# EAGLE schematic femtoBeacon_PRO_r3.0.1_single_sided (EAGLE 7.6.0)

## Sheet 1 of 2
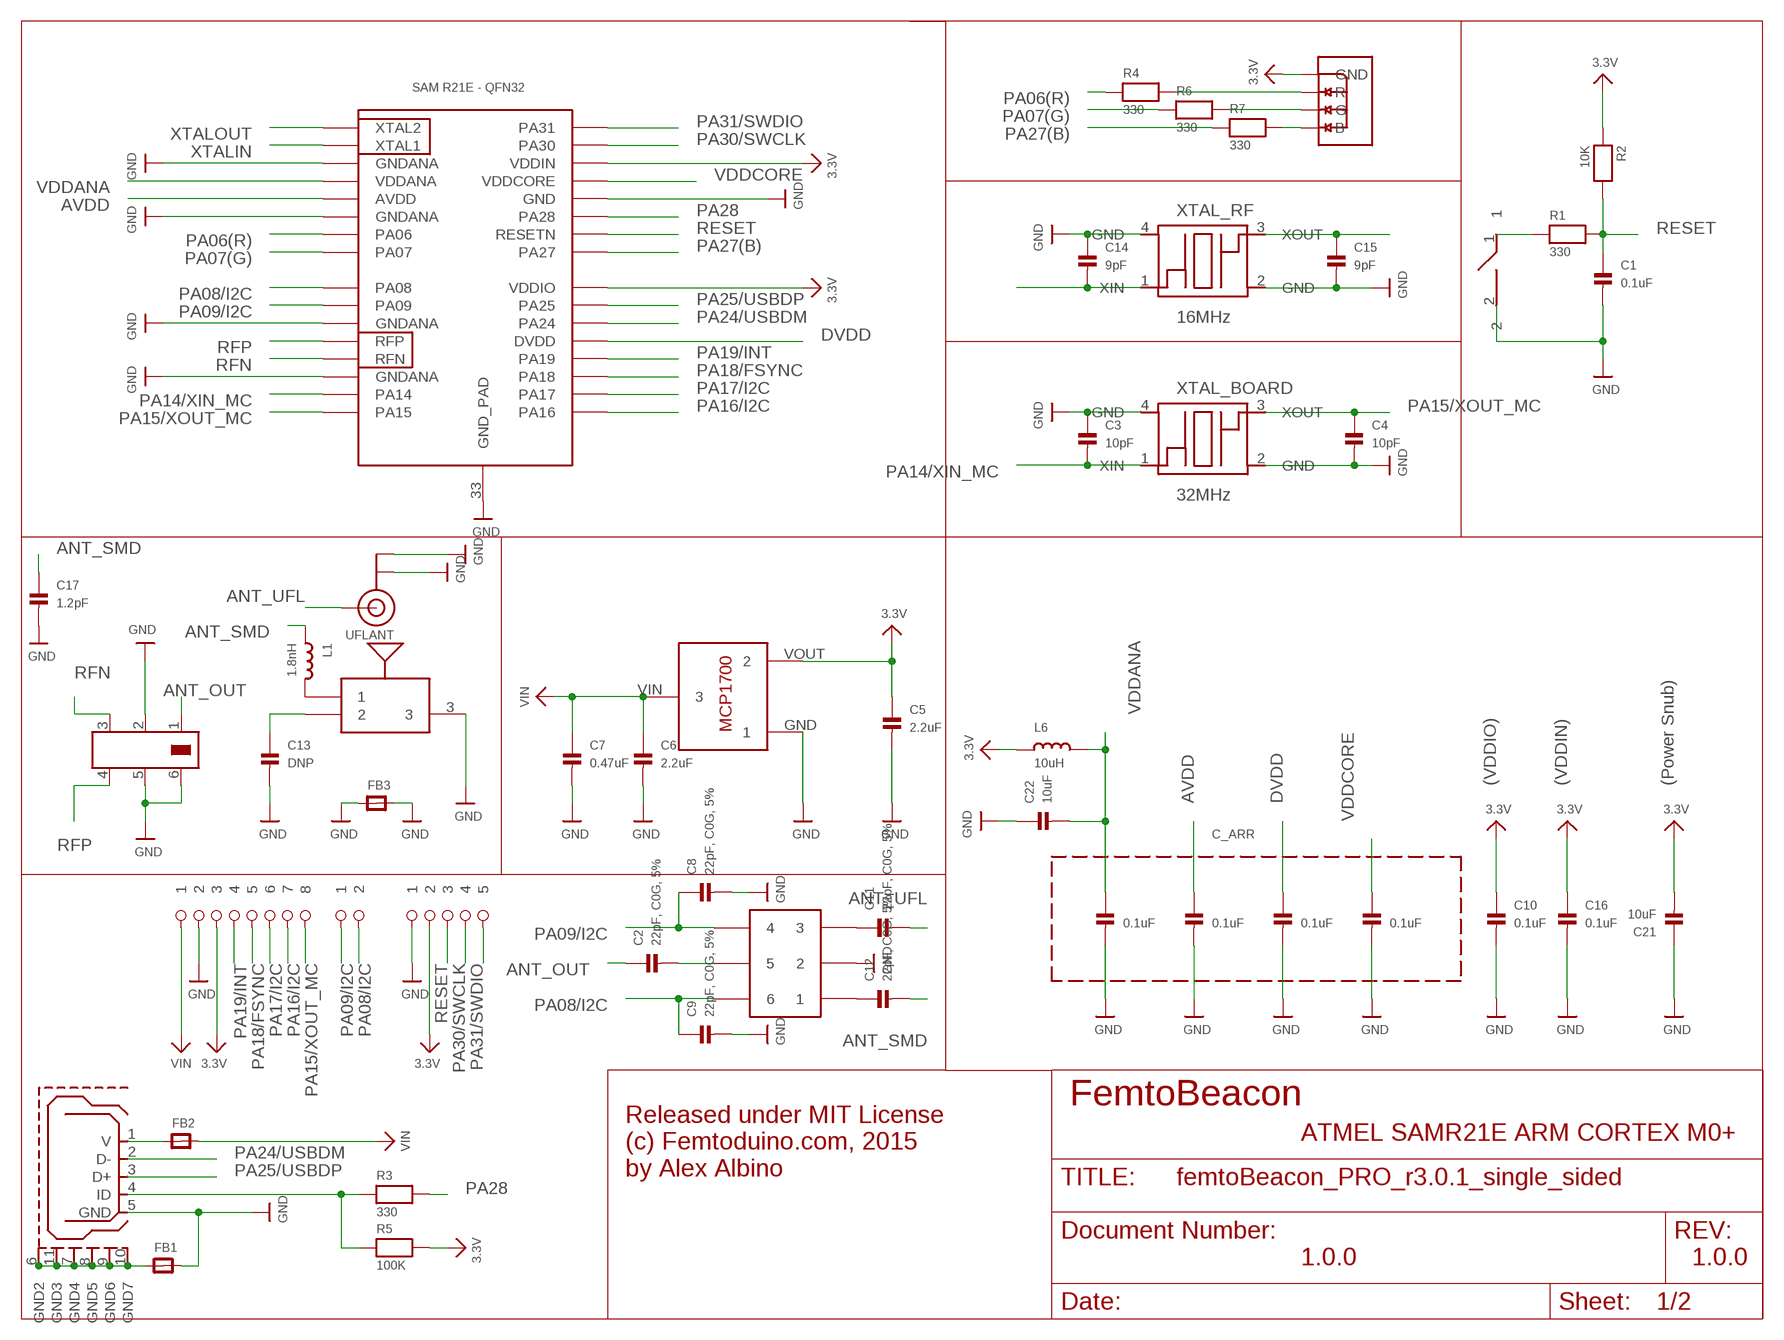
[diagram p0: schematic, sheet 1]

### Parts
ASWITCH  AS222-92LF  [AS222-92LF]
BALUN  JOHANSON_2450BM15A0015E  [0805_BALUN]
BTN_RESET  DNP  SPST_SMD  [SPST_SMD]
C1  0.1uF  CAP_CERAMIC_0402MP  [_0402MP]
C2  22pF, C0G, 5%  CAP_CERAMIC_0402MP  [_0402MP]
C3  10pF  CAP_CERAMIC_0402MP  [_0402MP]
C4  10pF  CAP_CERAMIC_0402MP  [_0402MP]
C5  2.2uF  CAP_CERAMIC_0402MP  [_0402MP]
C6  2.2uF  CAP_CERAMIC_0402MP  [_0402MP]
C7  0.47uF  CAP_CERAMIC_0402MP  [_0402MP]
C8  22pF, C0G, 5%  CAP_CERAMIC_0402MP  [_0402MP]
C9  22pF, C0G, 5%  CAP_CERAMIC_0402MP  [_0402MP]
C10  0.1uF  CAP_CERAMIC_0402MP  [_0402MP]
C11  22pF, C0G, 5%  CAP_CERAMIC_0402MP  [_0402MP]
C12  22pF, C0G, 5%  CAP_CERAMIC_0402MP  [_0402MP]
C13  DNP  CAP_CERAMIC_0402MP  [_0402MP]
C14  9pF  CAP_CERAMIC_0402MP  [_0402MP]
C15  9pF  CAP_CERAMIC_0402MP  [_0402MP]
C16  0.1uF  CAP_CERAMIC_0402MP  [_0402MP]
C17  1.2pF  CAP_CERAMIC_0402MP  [_0402MP]
C21  10uF  CAP_CERAMIC_0402MP  [_0402MP]
C22  10uF  CAP_CERAMIC_0402MP  [_0402MP]
C_ARR  0.1uF  KEMET_CERAMIC_CAPACITOR_ARRAY_1X4  [CAPACITOR_ARRAY_1206_MONO_1X4]
FB1  FERRITE_0603MP  [_0603MP]
FB2  FERRITE_0603MP  [_0603MP]
FB3  FERRITE_0603MP  [_0603MP]
IC  ATSAMR21E18A-MUT  [QFN32]
L1  1.8nH  INDUCTOR_0603MP  [_0603MP]
L6  10uH  INDUCTOR_0603MP  [_0603MP]
LDO_VREG  MCP1700T-3302E/TT  [MCP1700T-3302E/TT]
R1  330  RESISTOR_0402MP  [_0402MP]
R2  10K  RESISTOR_0402MP  [_0402MP]
R3  330  RESISTOR_0402MP  [_0402MP]
R4  330  RESISTOR_0402MP  [_0402MP]
R5  100K  RESISTOR_0402MP  [_0402MP]
R6  330  RESISTOR_0402MP  [_0402MP]
R7  330  RESISTOR_0402MP  [_0402MP]
RGBLED  LRTB_R48G  [LRTB_R48G]
SMDANT  PULSE_ANT_2.4GHZ  [ANT_BAR]
U$5  1X8_ROUND  [1X8_ROUND]
U$9  1X2_ROUND  [1X2_ROUND]
U$10  1X5_ROUND  [1X5_ROUND]
UFLANT  ANTENNA_U.FL  [U.FL]
USB  USB_MICROB  [USB_MICROB_PACKAGE]
XTAL_BOARD  32MHz  FA-128  [FA-128]
XTAL_RF  16MHz  TSX-3225  [TSX-3225]

### Nets
3.3V: C5.1 C10.1 C16.1 C21.2 IC.24(VDDIO) IC.30(VDDIN) L6.1 LDO_VREG.VOUT R2.1 R5.2 RGBLED.1(GND) U$5.P$3 U$10.P$2 ; also sheet 2
ANT_OUT: BALUN.1 C2.1
ANT_SMD: C12.2 C17.1 L1.1
ANT_UFL: C11.2 UFLANT.3(SIGNAL)
AVDD: C_ARR.3 IC.5(AVDD)
DVDD: C_ARR.5 IC.21(DVDD)
GND: ASWITCH.PIN2 BALUN.2 BALUN.5 BALUN.6 BTN_RESET.2 C1.2 C3.1 C4.2 C5.2 C6.2 C7.2 C8.2 C9.2 C10.2 C13.2 C14.1 C15.2 C16.2 C17.2 C21.1 C22.1 C_ARR.2 C_ARR.4 C_ARR.6 C_ARR.8 FB1.2 FB3.1 FB3.2 IC.3(GNDANA) IC.6(GNDANA) IC.11(GNDANA) IC.14(GNDANA) IC.28(GND) IC.33(GND_PAD) LDO_VREG.GND SMDANT.3 U$5.P$2 U$10.P$1 UFLANT.1(GND) UFLANT.2(GND) USB.5(GND) XTAL_BOARD.2(GND) XTAL_BOARD.4(GND) XTAL_RF.2(GND) XTAL_RF.4(GND) ; also sheet 2
N$1: L1.2 SMDANT.1
N$2: C13.1 SMDANT.2
N$3: ASWITCH.PIN5 C2.2
N$5: FB1.1 USB.6(GND2) USB.7(GND4) USB.8(GND5) USB.9(GND6) USB.10(GND7) USB.11(GND3)
N$6: R3.1 R5.1 USB.4(ID)
N$7: FB2.1 USB.1(V)
N$8: R6.2 RGBLED.3(G)
N$9: R7.2 RGBLED.4(B)
N$10: ASWITCH.PIN3 C11.1
N$11: ASWITCH.PIN1 C12.1
N$13: R4.2 RGBLED.2(R)
N$26: BTN_RESET.1 R1.1
PA06(R): IC.7(PA06) R4.1
PA07(G): IC.8(PA07) R6.1
PA08/I2C: ASWITCH.PIN6 C9.1 IC.9(PA08) U$9.P$2
PA09/I2C: ASWITCH.PIN4 C8.1 IC.10(PA09) U$9.P$1
PA14/XIN_MC: C3.2 IC.15(PA14) XTAL_BOARD.1(XIN)
PA15/XOUT_MC: C4.1 IC.16(PA15) U$5.P$8 XTAL_BOARD.3(XOUT)
PA16/I2C: IC.17(PA16) U$5.P$7 ; also sheet 2
PA17/I2C: IC.18(PA17) U$5.P$6 ; also sheet 2
PA18/FSYNC: IC.19(PA18) U$5.P$5 ; also sheet 2
PA19/INT: IC.20(PA19) U$5.P$4 ; also sheet 2
PA24/USBDM: IC.22(PA24) USB.2(D-)
PA25/USBDP: IC.23(PA25) USB.3(D+)
PA27(B): IC.25(PA27) R7.1
PA28: IC.27(PA28) R3.2
PA30/SWCLK: IC.31(PA30) U$10.P$4
PA31/SWDIO: IC.32(PA31) U$10.P$5
RESET: C1.1 IC.26(RESETN) R1.2 R2.2 U$10.P$3
RFN: BALUN.3 IC.13(RFN)
RFP: BALUN.4 IC.12(RFP)
VDDANA: C22.2 C_ARR.1 IC.4(VDDANA) L6.2
VDDCORE: C_ARR.7 IC.29(VDDCORE)
VIN: C6.1 C7.1 FB2.2 LDO_VREG.VIN U$5.P$1
XTALIN: C14.2 IC.2(XTAL1) XTAL_RF.1(XIN)
XTALOUT: C15.1 IC.1(XTAL2) XTAL_RF.3(XOUT)

### Notes on the sheet
- (VDDIO) | (VDDIN) | (Power Snub)
- FemtoBeacon
- ATMEL SAMR21E ARM CORTEX M0+
- Released under MIT License
  (c) Femtoduino.com, 2015
  by Alex Albino
- 1.0.0 | 1.0.0

## Sheet 2 of 2
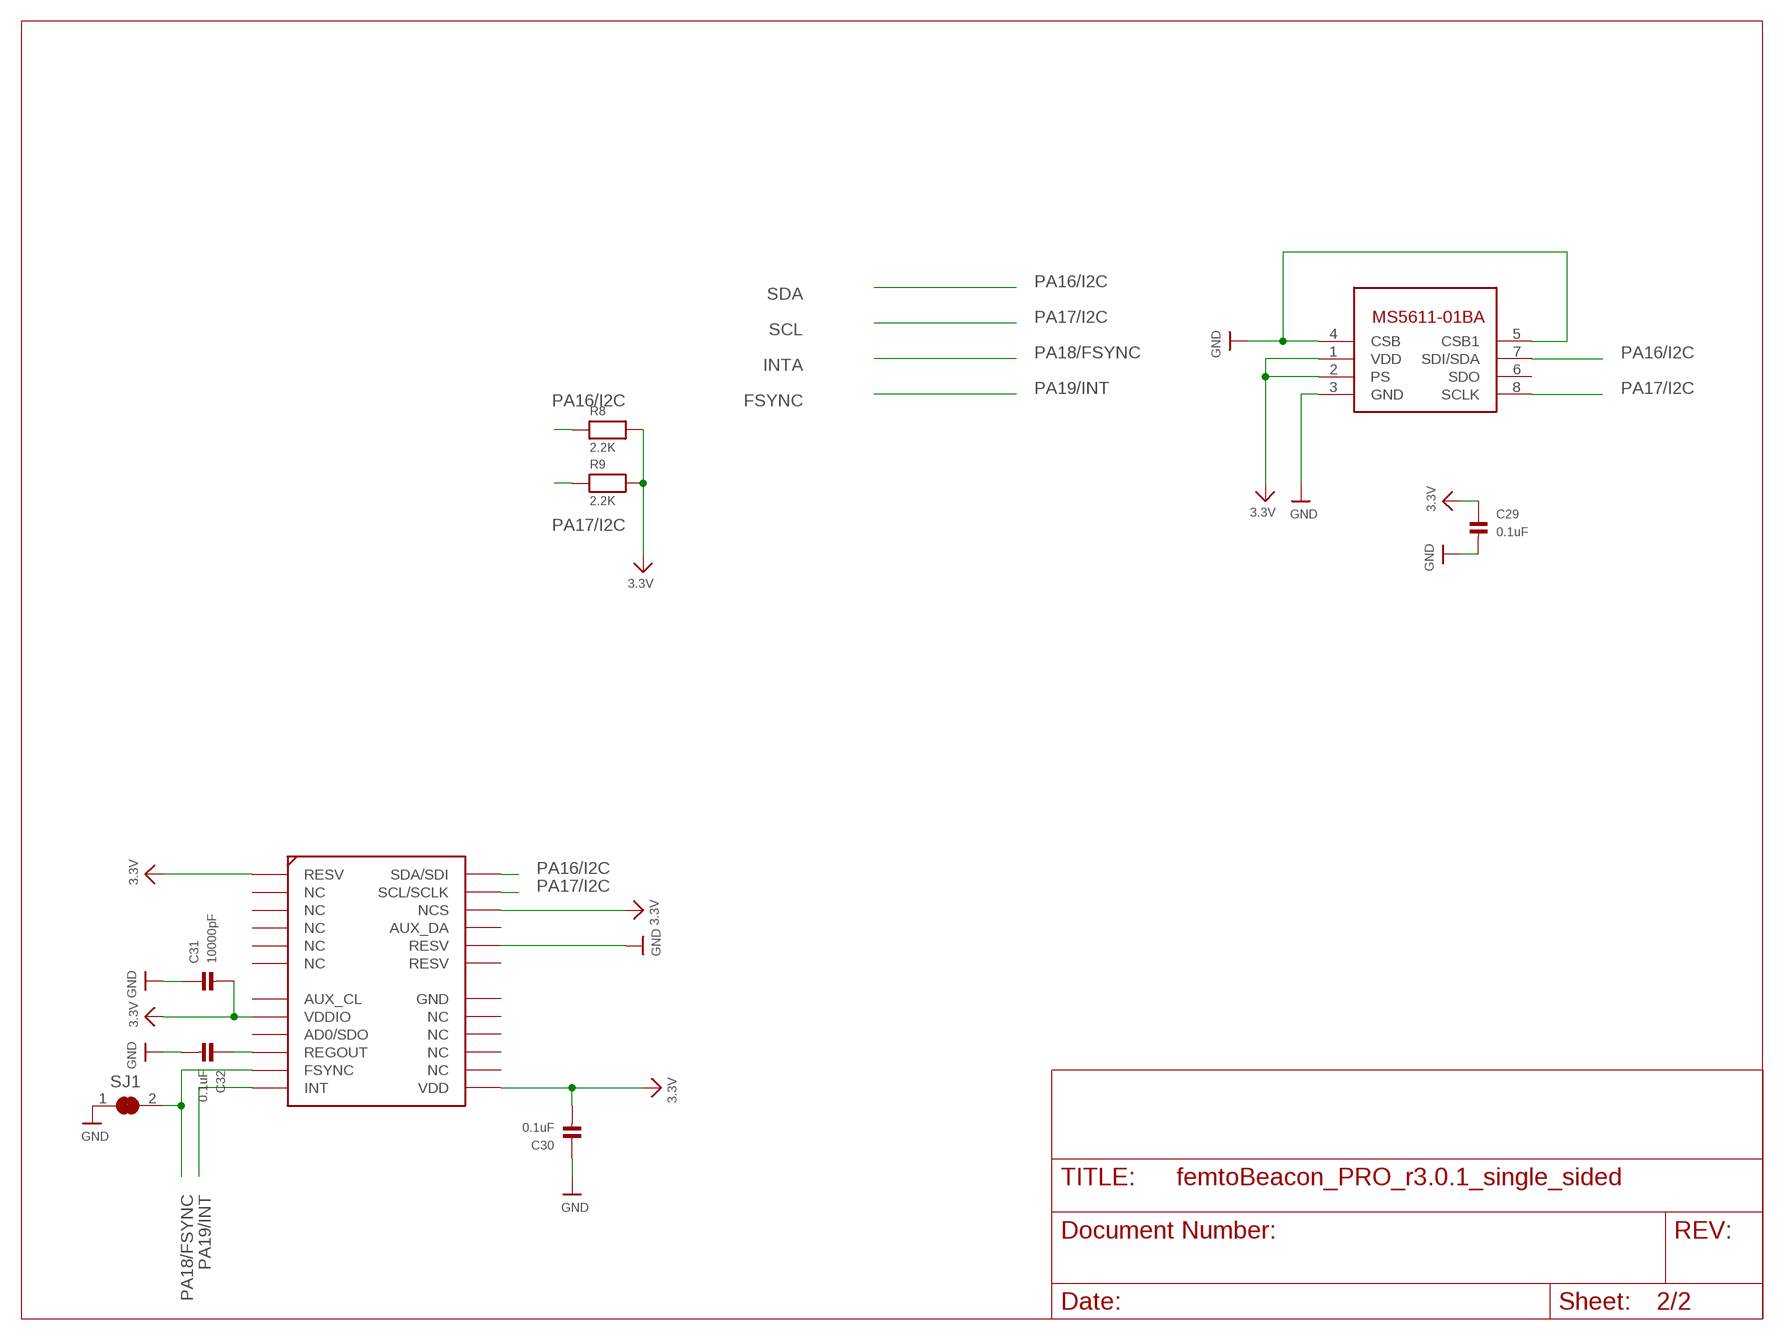
[diagram p1: schematic, sheet 2]

### Parts
BARO  MS5611-01BA03  [MS5611-01BA03]
C29  0.1uF  CAP_CERAMIC_0402MP  [_0402MP]
C30  0.1uF  CAP_CERAMIC_0402MP  [_0402MP]
C31  10000pF  CAP_CERAMIC_0402MP  [_0402MP]
C32  0.1uF  CAP_CERAMIC_0402MP  [_0402MP]
IMU  MPU-9250  [QFN_3X3MM]
R8  2.2K  RESISTOR_0402MP  [_0402MP]
R9  2.2K  RESISTOR_0402MP  [_0402MP]
SJ1  SOLDERJUMPER_CLOSED  [SOLDERJUMPER_CLOSEDWIRE]

### Nets
3.3V: BARO.1(VDD) BARO.2(PS) C29.1 C30.2 C31.2 IMU.P$1(RESV) IMU.P$8(VDDIO) IMU.P$13(VDD) IMU.P$22(NCS) R8.2 R9.2 ; also sheet 1
GND: BARO.3(GND) BARO.4(CSB) BARO.5(CSB1) C29.2 C30.1 C31.1 C32.2 IMU.P$20(RESV) SJ1.1 ; also sheet 1
N$4: C32.1 IMU.P$10(REGOUT)
PA16/I2C: BARO.7(SDI/SDA) IMU.P$24(SDA/SDI) R8.1 ; also sheet 1
PA17/I2C: BARO.8(SCLK) IMU.P$23(SCL/SCLK) R9.1 ; also sheet 1
PA18/FSYNC: IMU.P$11(FSYNC) SJ1.2 ; also sheet 1
PA19/INT: IMU.P$12(INT) ; also sheet 1
Unconnected: BARO.6(SDO) IMU.P$2(NC) IMU.P$3(NC) IMU.P$4(NC) IMU.P$5(NC) IMU.P$6(NC) IMU.P$7(AUX_CL) IMU.P$9(AD0/SDO) IMU.P$14(NC) IMU.P$15(NC) IMU.P$16(NC) IMU.P$17(NC) IMU.P$18(GND) IMU.P$19(RESV) IMU.P$21(AUX_DA)

### Notes on the sheet
- SDA
- SCL
- INTA
- FSYNC

## Library data of the parts
ASWITCH = skyworks_solutions:AS222-92LF
BALUN = balun:JOHANSON_2450BM15A0015E
BARO = freeimu:MS5611-01BA03
BTN_RESET = femtoduino:SPST_SMD
C1-C4 C8-C16 C29-C32 = microbuilder:CAP_CERAMIC: Ceramic Capacitors 0402 - 0402 Surface Mount Capacitors 16pF 50V 5% [Digikey: 445-4899-2-ND] 18pF 50V 5% [Digikey: 490-1281-2-ND] 22pF 50V 5% [Digikey: 490-1283-2-ND] 68pF 50V 5% [Digikey: 490-1289-2-ND] 0.1uF 10V 10% [Digikey: 490-1318-2-ND] 1.0uF 6.3V 10% [Digikey: 490-1320-2-ND] 0603 - 0603 Surface Mount Capacitors 16 pF 50V 5% [Digikey: 445-5051-2-ND] 22 pF 50V [Digikey: PCC220ACVTR-ND] 33 pF 50V 5% [Digikey: 490-1415-1-ND] 56pF 50V 5% [Digikey: 490-1421-1-ND] 220pF 50V 5% [Digikey: 445-1285-1-ND] 680 pF 50V 2200 pF 50V 5% C0G [Digikey: 445-1297-1-ND] 5600 pF 100V 5% X7R [Digikey: 478-3711-1-ND] 0.1 µF 25V 10% [Digikey: PCC2277TR-ND] 0.22 µF 16V 10% X7R [Digikey: 445-1318-1-ND] 1.0 µF 25V 10% [Digikey: 445-5146-2-ND] 0603 - RF Specific 3pF 250V +/-0.1pF RF [Digikey: 712-1347-1-ND] 18 pF 250V 5% [Digikey: 478-3505-1-ND or 712-1322-1-ND] 56 pF 250V 5% C0G RF [Digikey: 490-4867-1-ND] 68 pF 250V RF [Digikey: 490-4868-1-ND] 0805 - 0805 Surface Mount Capacitors 220 pF 250V 2% RF Ceramic Capacitor [Digikey: 712-1398-1-ND] 1000 pF 50V 2% NP0 Ceramic Capacitor [Digikey: 478-3760-1-ND] 0.1 µF 25V 10% Ceramic Capacitor [Digikey: PCC1828TR-ND] 1.0 µF 16V 10% Ceramic Capacitor[Digikey: 490-1691-2-ND] 10.0 µF 10V 10% Ceramic Capacitor[Digikey: 709-1228-1-ND] 10.0 uF 16V 10% Ceramic Capacitor [Digikey: 478-5165-2-ND] 47 uF 6.3V 20% Ceramic Capacitor [Digikey: 587-1779-1-ND or 399-5506-1-ND] 1206 - 1206 Surface Mount Capacitors 47uF 10V 20% Ceramic Capacitor [Digikey: 490-5528-1-ND or 399-5508-1-ND or 445-6010-1-ND] 100uF 6.3V -20%, +80% Y5V Ceramic Capacitor (Digikey: 490-4512-1-ND, Mouser: 81-GRM31CF50J107ZE1L); DIGIKEY_PART: 490-3194-1-ND
C5-C7 C17 C21 C22 = microbuilder:CAP_CERAMIC: Ceramic Capacitors 0402 - 0402 Surface Mount Capacitors 16pF 50V 5% [Digikey: 445-4899-2-ND] 18pF 50V 5% [Digikey: 490-1281-2-ND] 22pF 50V 5% [Digikey: 490-1283-2-ND] 68pF 50V 5% [Digikey: 490-1289-2-ND] 0.1uF 10V 10% [Digikey: 490-1318-2-ND] 1.0uF 6.3V 10% [Digikey: 490-1320-2-ND] 0603 - 0603 Surface Mount Capacitors 16 pF 50V 5% [Digikey: 445-5051-2-ND] 22 pF 50V [Digikey: PCC220ACVTR-ND] 33 pF 50V 5% [Digikey: 490-1415-1-ND] 56pF 50V 5% [Digikey: 490-1421-1-ND] 220pF 50V 5% [Digikey: 445-1285-1-ND] 680 pF 50V 2200 pF 50V 5% C0G [Digikey: 445-1297-1-ND] 5600 pF 100V 5% X7R [Digikey: 478-3711-1-ND] 0.1 µF 25V 10% [Digikey: PCC2277TR-ND] 0.22 µF 16V 10% X7R [Digikey: 445-1318-1-ND] 1.0 µF 25V 10% [Digikey: 445-5146-2-ND] 0603 - RF Specific 3pF 250V +/-0.1pF RF [Digikey: 712-1347-1-ND] 18 pF 250V 5% [Digikey: 478-3505-1-ND or 712-1322-1-ND] 56 pF 250V 5% C0G RF [Digikey: 490-4867-1-ND] 68 pF 250V RF [Digikey: 490-4868-1-ND] 0805 - 0805 Surface Mount Capacitors 220 pF 250V 2% RF Ceramic Capacitor [Digikey: 712-1398-1-ND] 1000 pF 50V 2% NP0 Ceramic Capacitor [Digikey: 478-3760-1-ND] 0.1 µF 25V 10% Ceramic Capacitor [Digikey: PCC1828TR-ND] 1.0 µF 16V 10% Ceramic Capacitor[Digikey: 490-1691-2-ND] 10.0 µF 10V 10% Ceramic Capacitor[Digikey: 709-1228-1-ND] 10.0 uF 16V 10% Ceramic Capacitor [Digikey: 478-5165-2-ND] 47 uF 6.3V 20% Ceramic Capacitor [Digikey: 587-1779-1-ND or 399-5506-1-ND] 1206 - 1206 Surface Mount Capacitors 47uF 10V 20% Ceramic Capacitor [Digikey: 490-5528-1-ND or 399-5508-1-ND or 445-6010-1-ND] 100uF 6.3V -20%, +80% Y5V Ceramic Capacitor (Digikey: 490-4512-1-ND, Mouser: 81-GRM31CF50J107ZE1L)
C_ARR = array-capacitor:KEMET_CERAMIC_CAPACITOR_ARRAY_1X4; MFR_ID: CA064C104K4RACTU
FB1-FB3 = microbuilder:FERRITE: Ferrite Bead 0603 MMZ1608B121C - 120 Ohm @ 100MHz, 600mA, 0.15 Ohm DC Resistance - Digikey: 445-2164-1-ND BK1608HW121-T - 120 Ohm, 600mA Ferrite Chip - Digikey: 587-1876-2-ND 0805 HZ0805B272R-10 - 2.7K Ohm @ 100MHz, 200mA, 0.8 Ohm DC Resistance - Digikey: 240-2504-1-ND (see also Murata BLM21BD272SN1L) MMZ2012Y152B - 1.5K Ohm @ 100MHz, 500mA, 0.4 Ohm DC Resistance - Digikey: 445-1560-1-ND - Mainly for high frequency (80-400MHz) MMZ2012R102A - 1K Ohm @ 100MHz, 500mA, 0.3 Ohm DC Resistance - Digikey: 445-1555-2-ND - More general purpose (10-200MHz)
IC = atmel-samr21:ATSAMR21E18A-MUT: This is the ATMEL SAMR21E QFN-32. ATSAMR21E18A
IMU = mpu9250:MPU-9250
L1 = microbuilder:INDUCTOR: Inductors 0603: 10nH Ceramic Inductor - microwire antenna/RF (Digikey: 712-1434-2-ND) 0805: 560nH Ceramic Inductor - RF (Digikey: 553-1047-1-ND) 270nH Ceramic Inductor - Q = 40@250MHz, +-5%, 1 Ohm DC Resistance (Digikey: 535-10506-2-ND) 1007 (2518 Metric) SMT: 10µH 10% 250mOhm 820mA 1007 Inductor (Digikey: 587-2189-1-ND) 22µH 10% 500mOhm 580mA 1007 Inductor (Digikey: 587-2190-1-ND) 47µH 10% 950mOhm 420mA 1007 Inductor (Digikey: 587-2191-1-ND) 47µH 5% 100mOhm 1A 1008 Inductor (Digikey: 732-1816-1-ND) 5.0x5.0mm (Taiyo Yuden NR5040 Series) 6.8µH 20% 2.3A 64mOhm Inductor (Digikey: 587-2374-2-ND) 5.0x5.0mm (TDK VLC5045 Series) 4.7µH 20% 3.3A 34mOhm Inductor (Digikey: 445-6526-1-ND) 6.8µH 20% 2.7A 46mOhm Inductor (Digikey: 445-6527-1-ND) 6.0x6.0mm (TDK VLC6045 Series) 4.7µH 20% 3.8A 27mOhm Inductor (Digikey: 445-6538-2-ND) 6.8µH 20% 3A 41mOhm Inductor (Digikey: 445-6540-1-ND) 6.2µH 30% 2.2A 45mOhm Inductor (Digikey: SRR5028-6R2YCT-ND) - Not TDK VLC6045 but footprint should match 6.0x6.0mm (TDK SLF6045 Series) 6.8uH 30% 2A 33mOhm Inductor (Digikey: 445-4572-1-ND, Mouser: 810-SLF645T6R8N2R0PF); MFR_ID: L-05B1N8SV6T
L6 = microbuilder:INDUCTOR: Inductors 0603: 10nH Ceramic Inductor - microwire antenna/RF (Digikey: 712-1434-2-ND) 0805: 560nH Ceramic Inductor - RF (Digikey: 553-1047-1-ND) 270nH Ceramic Inductor - Q = 40@250MHz, +-5%, 1 Ohm DC Resistance (Digikey: 535-10506-2-ND) 1007 (2518 Metric) SMT: 10µH 10% 250mOhm 820mA 1007 Inductor (Digikey: 587-2189-1-ND) 22µH 10% 500mOhm 580mA 1007 Inductor (Digikey: 587-2190-1-ND) 47µH 10% 950mOhm 420mA 1007 Inductor (Digikey: 587-2191-1-ND) 47µH 5% 100mOhm 1A 1008 Inductor (Digikey: 732-1816-1-ND) 5.0x5.0mm (Taiyo Yuden NR5040 Series) 6.8µH 20% 2.3A 64mOhm Inductor (Digikey: 587-2374-2-ND) 5.0x5.0mm (TDK VLC5045 Series) 4.7µH 20% 3.3A 34mOhm Inductor (Digikey: 445-6526-1-ND) 6.8µH 20% 2.7A 46mOhm Inductor (Digikey: 445-6527-1-ND) 6.0x6.0mm (TDK VLC6045 Series) 4.7µH 20% 3.8A 27mOhm Inductor (Digikey: 445-6538-2-ND) 6.8µH 20% 3A 41mOhm Inductor (Digikey: 445-6540-1-ND) 6.2µH 30% 2.2A 45mOhm Inductor (Digikey: SRR5028-6R2YCT-ND) - Not TDK VLC6045 but footprint should match 6.0x6.0mm (TDK SLF6045 Series) 6.8uH 30% 2A 33mOhm Inductor (Digikey: 445-4572-1-ND, Mouser: 810-SLF645T6R8N2R0PF)
LDO_VREG = MCP1700T-3302E_TT:MCP1700T-3302E/TT: Microchip LDO "MCP1700" in a 3-Pin SOT-23 package. ID: MCP1700T-3302E/TT
R1-R9 = microbuilder:RESISTOR: Resistors 0402 - 0402 Surface Mount Package 22 Ohm 1% 1/16W [Digikey: 311-22.0LRTR-ND] 33 Ohm 5% 1/16W 1.0K 5% 1/16W 1.5K 5% 1/16W 2.0K 1% 1/16W 10.0K 1% 1/16W [Digikey: 311-10.0KLRTR-ND] 10.0K 5% 1/16W [Digikey: RMCF0402JT10K0TR-ND] 12.1K 1% 1/16W [Digikey: 311-22.0LRTR-ND] 100.0K 5% 1/16W 0603 - 0603 Surface Mount Package 0 Ohm 1/10 Watt 1% Resistor 15 Ohm 1/10 Watt 1% Resistor 33 Ohm 1/10 Watt 1% Resistor 49.9 Ohm 1/10 Watt 1% Resistor 100 Ohm 1/10 Watt 1% Resistor 150 Ohm 1/10 Watt 1% Resistor 240 Ohm 1/10 Watt 1% Resistor 390 Ohm 1/10 Watt 1% Resistor 560 Ohm 1/10 Watt 1% Resistor 680 Ohm 1/10 Watt 1% Resistor 750 Ohm 1/10 Watt 1% Resistor 1.0K Ohm 1/10 Watt 1% Resistor 1.5K Ohm 1/10 Watt 1% Resistor 2.0K Ohm 1/10 Watt 1% Resistor 2.2K Ohm 1/10 Watt 1% Resistor 3.3K Ohm 1/10 Watt 1% Resistor 4.7K Ohm 1/10 Watt 1% Resistor 10.0K Ohm 1/10 Watt 1% Resistor 12.0K Ohm 1/10 Watt 1% Resistor 12.1K Ohm 1/10 Watt 1% Resistor 20.0K Ohm 1/10 Watt 1% Resistor 33.0K Ohm 1/10 Watt 1% Resistor 100.0K Ohm 1/10 Watt 1% Resistor 0805 - 0805 Surface Mount Package 0 Ohm 1/8 Watt 1% Resistor 33 Ohm 1/8 Watt 1% Resistor 100 Ohm 1/8 Watt 1% Resistor 150 Ohm 1/8 Watt 1% Resistor 200 Ohm 1/8 Watt 1% Resistor 240 Ohm 1/8 Watt 1% Resistor 330 Ohm 1/8 Watt 1% Resistor 390 Ohm 1/8 Watt 1% Resistor 470 Ohm 1/8 Watt 1% Resistor 1.0K Ohm 1/8 Watt 1% Resistor 1.5K Ohm 1/8 Watt 1% Resistor 2.0K Ohm 1/8 Watt 1% Resistor 4.7K Ohm 1/8 Watt 1% Resistor 5.1K Ohm 1/8 Watt 1% Resistor 5.6K Ohm 1/8 Watt 1% Resistor 10.0K Ohm 1/8 Watt 1% Resistor 22.0K Ohm 1/8 Watt 1% Resistor 33.0K Ohm 1/8 Watt 1% Resistor 100K Ohm 1/8 Watt 1% Resistor 1206 - 1206 Surface Mount Package 2012 - 2010 Surface Mount Package 0.11 Ohm 1/2 Watt 1% Resistor - Digikey: RHM.11UCT-ND
RGBLED = osram_opto_LED:LRTB_R48G; MFR_ID: LRTB R48G
SJ1 = microbuilder:SOLDERJUMPER_CLOSED: Solder Jumper - Closed These solder jumpers are closed by default CLOSEDWIRE - 10 mil trace between pads that can be cut and resoldered later CLOSEDPERM - 63 mil trace between pads for a permanent connection (used to 'bridge' two signals, a shameless hack for Eagle). Can double as a test point as well (no cream layer)
SMDANT = bar_antenna:PULSE_ANT_2.4GHZ: Manufacturer part #W3008
U$5 = pins_1.27mm_pitch:1X8_ROUND
U$9 = pins_1.27mm_pitch:1X2_ROUND
U$10 = pins_1.27mm_pitch:1X5_ROUND
UFLANT = adafruit:ANTENNA_U.FL: U.FL Antenna Connector
USB = femtoduino:USB_MICROB: This is the hirose ZX62-B-5PA(11) MICRO-USB B Type female connection.
XTAL_BOARD = crystals:FA-128
XTAL_RF = crystals:TSX-3225